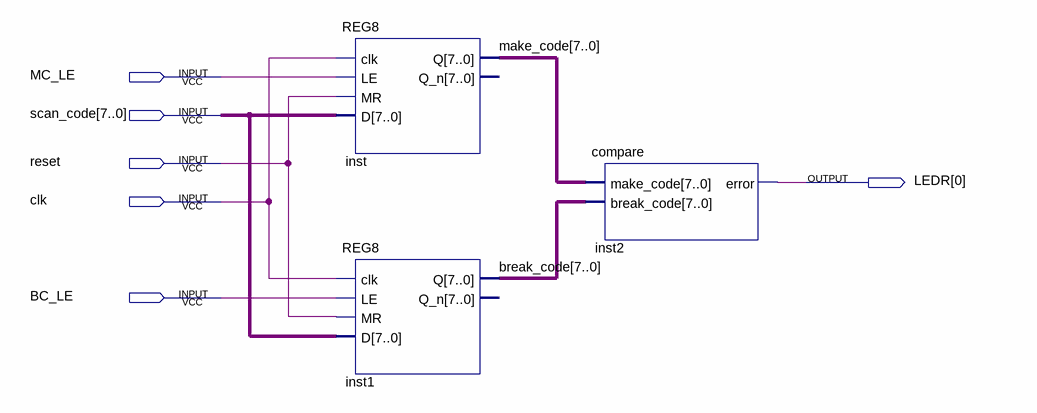
[diagram p0: schematic sheet]
// Quartus schematic store_and_error.bdf as structural Verilog: 3 symbols, 6 pins
module store_and_error (
  input  MC_LE,
  input  [7:0] scan_code,
  input  reset,
  input  clk,
  input  BC_LE,
  output [0:0] LEDR
);

  wire [7:0] break_code, make_code;

  REG8 inst (.clk(clk), .LE(MC_LE), .MR(reset), .D(scan_code), .Q(make_code));  // open: Q_n
  REG8 inst1 (.clk(clk), .LE(BC_LE), .MR(reset), .D(scan_code), .Q(break_code));  // open: Q_n
  compare inst2 (.make_code(make_code), .break_code(break_code), .error(LEDR[0]));
endmodule
